# Altium schematic sheet Sheet1.SchDoc
size A3
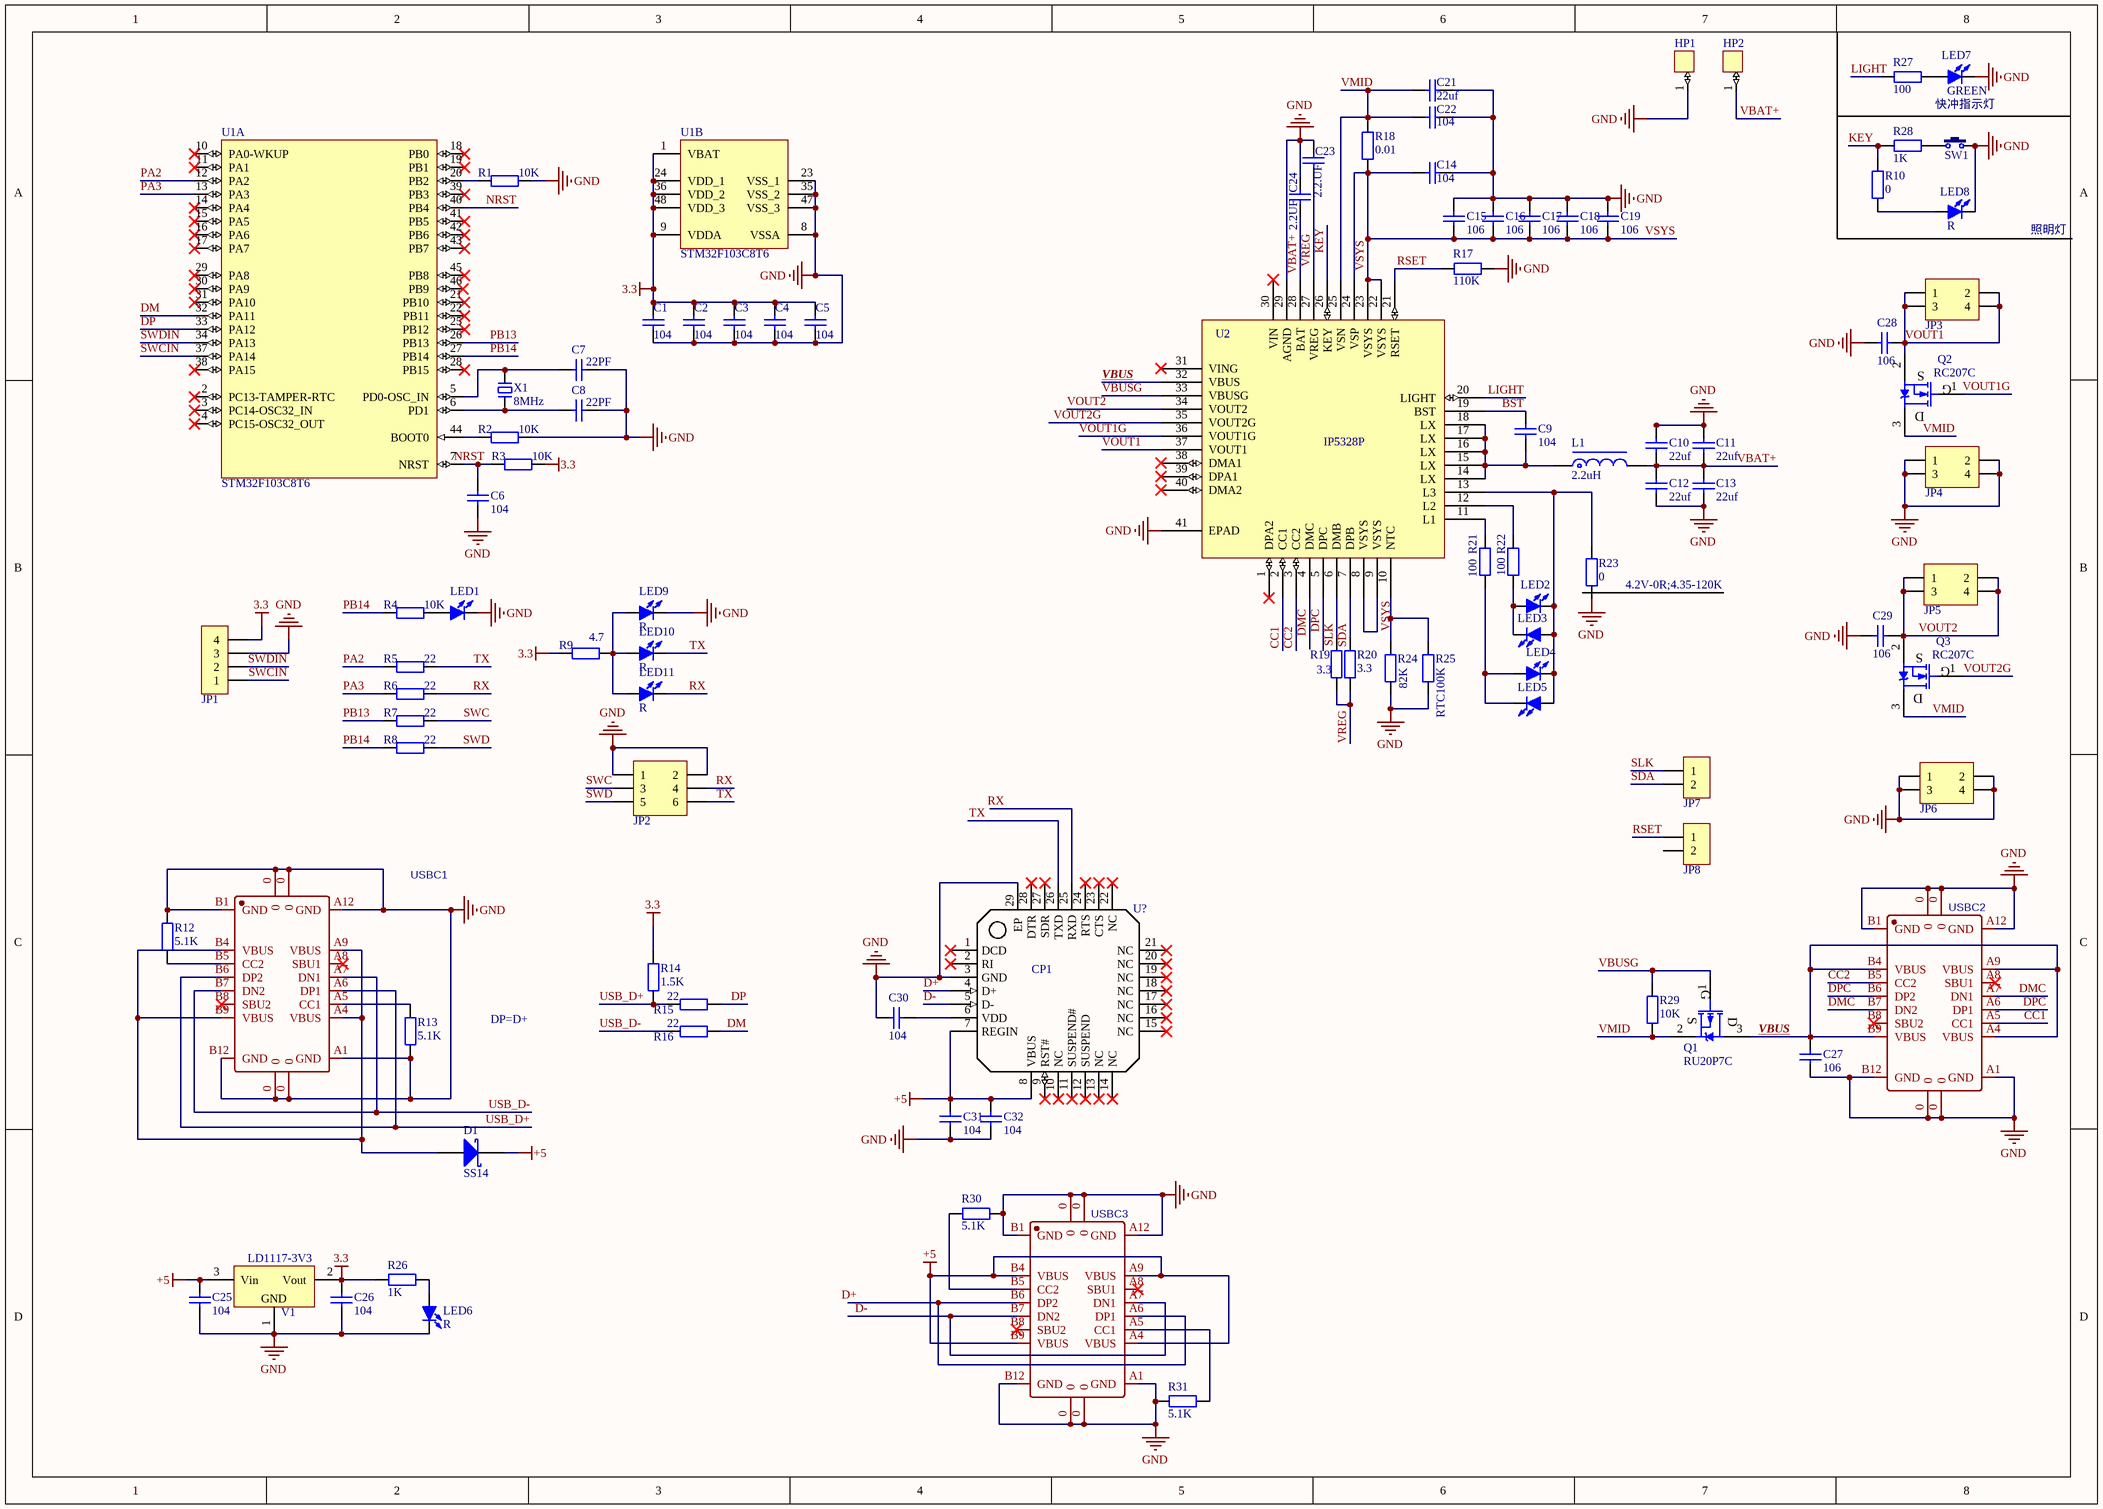
[diagram p0: Sheet1.SchDoc]

## Parts
C1  104  [C 0603_L]
C2  104  [C 0603_L]
C3  104  [C 0603_L]
C4  104  [C 0603_L]
C5  104  [C 0603_L]
C6  104  [C 0603_L]
C7  22PF  [C 0603_L]
C8  22PF  [C 0603_L]
C9  104  [C 0603_L]
C10  22uf  [C 0603_L]
C11  22uf  [C 0603_L]
C12  22uf  [C 0603_L]
C13  22uf  [C 0603_L]
C14  104  [C 0603_L]
C15  106  [C 0603_L]
C16  106  [C 0603_L]
C17  106  [C 0603_L]
C18  106  [C 0603_L]
C19  106  [C 0603_L]
C21  22uf  [C 0603_L]
C22  104  [C 0603_L]
C23  2.2.UF  [C 0603_L]
C24  2.2UF  [C 0603_L]
C25  104  [C 0603_L]
C26  104  [C 0603_L]
C27  106  [C 0603_L]
C28  106  [C 0603_L]
C29  106  [C 0603_L]
C30  104  [C 0603_L]
C31  104  [C 0603_L]
C32  104  [C 0603_L]
CP1  U?  [QFN28 5x5_N]
D1  SS14  [SOD-123]
HP1  (no value)  [焊盘1.5X1.5]
HP2  (no value)  [焊盘1.5X1.5]
JP1  HDR-1X4  [HDR2.54-LI-4P]  (value not drawn)
JP2  Header3X2  [HDR2.54-LI-2x3P]  (value not drawn)
JP3  Header2X2  [HDR2.54-LI-2x2P]  (value not drawn)
JP4  Header2X2  [HDR2.54-LI-2x2P]  (value not drawn)
JP5  Header2X2  [HDR2.54-LI-2x2P]  (value not drawn)
JP6  Header2X2  [HDR2.54-LI-2x2P]  (value not drawn)
JP7  HDR-1X2  [HDR2.54-LI-2P]  (value not drawn)
JP8  HDR-1X2  [HDR2.54-LI-2P]  (value not drawn)
L1  2.2uH  [CDRH73]
LED1  (no value)  [LED 0603R]
LED2  (no value)  [LED 0603R]
LED3  (no value)  [LED 0603R]
LED4  (no value)  [LED 0603R]
LED5  (no value)  [LED 0603R]
LED6  R  [LED 0603R]
LED7  GREEN  [LED 0603R]
LED8  R  [LED 5730-V]
LED9  R  [LED 0603Y]
LED10  R  [LED 0603Y]
LED11  R  [LED 0603Y]
Q1  RU20P7C  [SOT23-3N]
Q2  RC207C  [SOT23-3N]
Q3  RC207C  [SOT23-3N]
R1  10K  [R 0603_L]
R2  10K  [R 0603_L]
R3  10K  [R 0603_L]
R4  10K  [R 0603_L]
R5  22  [R 0603_L]
R6  22  [R 0603_L]
R7  22  [R 0603_L]
R8  22  [R 0603_L]
R9  4.7  [R 0603_L]
R10  0  [R 0603_L]
R12  5.1K  [R 0603_L]
R13  5.1K  [R 0603_L]
R14  1.5K  [R 0603_L]
R15  22  [R 0603_L]
R16  22  [R 0603_L]
R17  110K  [R 0603_L]
R18  0.01  [R 1206_L]
R19  3.3  [R 0603_L]
R20  3.3  [R 0603_L]
R21  100  [R 0603_L]
R22  100  [R 0603_L]
R23  0  [R 0603_L]
R24  82K  [R 0603_L]
R25  RTC100K  [R 0603_L]
R26  1K  [R 0603_L]
R27  100  [R 0603_L]
R28  1K  [R 0603_L]
R29  10K  [R 0603_L]
R30  5.1K  [R 0603_L]
R31  5.1K  [R 0603_L]
SW1  3x6x5  [TSW 3*6*4.3-S-W]  (value not drawn)
U1  STM32F103C8T6  [LQFP48_N]  (parts A,B of 2)
U2  IP5328P  [QFN40 6X6_N]
USBC1  TYPE-C 2.0 -16P  [USB-C-SMD_TYPE-C-USB-5]  (value not drawn)
USBC2  TYPE-C 2.0 -16P  [USB-C-SMD_TYPE-C-USB-5]  (value not drawn)
USBC3  TYPE-C 2.0 -16P  [USB-C-SMD_TYPE-C-USB-5]  (value not drawn)
V1  LD1117-3V3  [SOT89_L]
X1  8MHz  [OSC 5032-2P]

## Nets
3.3: C1.2 C2.2 C3.2 C4.2 C5.2 C26.2 JP1.4 R3.2 R9.1 R14.2 R26.1 U1.1(VBAT) U1.9(VDDA) U1.24(VDD_1) U1.36(VDD_2) U1.48(VDD_3) V1.2(Vout)
+5: C25.2 C31.1 C32.1 CP1.7(REGIN) CP1.8(VBUS) D1.2(K) USBC3.A4(VBUS) USBC3.A9(VBUS) USBC3.B4(VBUS) USBC3.B9(VBUS) V1.3(Vin)
GND: C1.1 C2.1 C3.1 C4.1 C5.1 C6.1 C7.1 C8.1 C10.2 C11.2 C12.1 C13.1 C14.1 C15.2 C16.2 C17.2 C18.2 C19.2 C21.1 C22.1 C23.2 C24.2 C25.1 C26.1 C27.1 C28.2 C29.1 C30.2 C31.2 C32.2 CP1.3(GND) CP1.29(EP) HP1.1 JP1.3 JP2.1 JP2.2 JP4.1 JP4.2 JP4.3 JP4.4 JP6.1 JP6.2 JP6.3 JP6.4 LED1.2(K) LED6.2(K) LED7.2(K) LED8.2(K) LED9.2(K) R1.2 R2.2 R12.2 R13.1 R17.2 R23.1 R24.2 R25.2 R30.2 R31.1 SW1.2 U1.8(VSSA) U1.23(VSS_1) U1.35(VSS_2) U1.47(VSS_3) U2.29(AGND) U2.41(EPAD) USBC1.0 USBC1.A1(GND) USBC1.A12(GND) USBC1.B1(GND) USBC1.B12(GND) USBC2.0 USBC2.A1(GND) USBC2.A12(GND) USBC2.B1(GND) USBC2.B12(GND) USBC3.0 USBC3.A1(GND) USBC3.A12(GND) USBC3.B1(GND) USBC3.B12(GND) V1.1(GND)
BST: C9.2 U2.19(BST)
CC1: U2.2(CC1) USBC2.A5(CC1)
CC2: U2.3(CC2) USBC2.B5(CC2)
D+: CP1.4(D+) USBC3.A6(DP1) USBC3.B6(DP2)
D-: CP1.5(D-) USBC3.A7(DN1) USBC3.B7(DN2)
DM: R16.2 U1.32(PA11)
DMC: U2.4(DMC) USBC2.A7(DN1) USBC2.B7(DN2)
DP: R15.2 U1.33(PA12)
DPC: U2.5(DPC) USBC2.A6(DP1) USBC2.B6(DP2)
KEY: R10.2 R28.1 U2.26(KEY)
LIGHT: R27.1 U2.20(LIGHT)
NRST: C6.2 R3.1 U1.7(NRST) U1.40(PB4)
PA2: R5.1 U1.12(PA2)
PA3: R6.1 U1.13(PA3)
PB13: R7.1 U1.26(PB13)
PB14: R4.1 R8.1 U1.27(PB14)
RSET: JP8.1 R17.1 U2.21(RSET)
RX: CP1.25(RXD) JP2.4 LED11.2(K) R6.2
SDA: JP7.2 R20.2 U2.7(DPB)
SLK: JP7.1 R19.1 U2.6(DMB)
SWC: JP2.3 R7.2
SWCIN: JP1.1 U1.37(PA14)
SWD: JP2.5 R8.2
SWDIN: JP1.2 U1.34(PA13)
TX: CP1.26(TXD) JP2.6 LED10.2(K) R5.2
USB_D+: R14.1 R15.1 USBC1.A6(DP1) USBC1.B6(DP2)
USB_D-: R16.1 USBC1.A7(DN1) USBC1.B7(DN2)
VBAT+: C10.1 C11.1 C12.2 C13.2 C24.1 HP2.1 L1.2 U2.28(BAT)
VBUS: C27.2 Q1.3(D) U2.32(VBUS) USBC2.A4(VBUS) USBC2.A9(VBUS) USBC2.B4(VBUS) USBC2.B9(VBUS)
VBUSG: Q1.1(G) R29.2 U2.33(VBUSG)
VMID: C21.2 C22.2 Q1.2(S) Q2.3(D) Q3.3(D) R18.1 R29.1 U2.25(VSN)
VOUT1: C28.1 JP3.1 JP3.2 JP3.3 JP3.4 Q2.2(S) U2.37(VOUT1)
VOUT1G: Q2.1(G) U2.36(VOUT1G)
VOUT2: C29.2 JP5.1 JP5.2 JP5.3 JP5.4 Q3.2(S) U2.34(VOUT2)
VOUT2G: Q3.1(G) U2.35(VOUT2G)
VREG: C23.1 R19.2 R20.1 U2.27(VREG)
VSYS: C14.2 C15.1 C16.1 C17.1 C18.1 C19.1 R18.2 U2.8(VSYS) U2.9(VSYS) U2.22(VSYS) U2.23(VSYS) U2.24(VSP)
NetC7_2: C7.2 U1.5(PD0-OSC_IN) X1.2
NetC8_2: C8.2 U1.6(PD1) X1.1
NetC9_1: C9.1 L1.1 U2.14(LX) U2.15(LX) U2.16(LX) U2.17(LX) U2.18(LX)
NetC30_1: C30.1 CP1.6(VDD)
NetD1_1: D1.1(A) USBC1.A4(VBUS) USBC1.A9(VBUS) USBC1.B4(VBUS) USBC1.B9(VBUS)
NetLED1_1: LED1.1(A) R4.2
NetLED2_1: LED2.1(A) LED3.2(K) R22.1
NetLED2_2: LED2.2(K) LED3.1(A) LED4.2(K) LED5.1(A) R23.2 U2.13(L3)
NetLED4_1: LED4.1(A) LED5.2(K) R21.1
NetLED6_1: LED6.1(A) R26.2
NetLED7_1: LED7.1(A) R27.2
NetLED8_1: LED8.1(A) R10.1
NetLED9_1: LED9.1(A) LED10.1(A) LED11.1(A) R9.2
NetR1_1: R1.1 U1.20(PB2)
NetR2_1: R2.1 U1.44(BOOT0)
NetR12_1: R12.1 USBC1.B5(CC2)
NetR13_2: R13.2 USBC1.A5(CC1)
NetR21_2: R21.2 U2.11(L1)
NetR22_2: R22.2 U2.12(L2)
NetR24_1: R24.1 R25.1 U2.10(NTC)
NetR28_2: R28.2 SW1.1
NetR30_1: R30.1 USBC3.B5(CC2)
NetR31_2: R31.2 USBC3.A5(CC1)

Not connected (* = marked no-connect by the designer): CP1 1(DCD)* 2(RI)* 9(RST#)* 10(NC)* 11(SUSPEND#)* 12(SUSPEND)* 13(NC)* 14(NC)* 15(NC)* 16(NC)* 17(NC)* 18(NC)* 19(NC)* 20(NC)* 21(NC)* 22(NC)* 23(CTS)* 24(RTS)* 27(SDR)* 28(DTR)*; JP8 2; U1 2(PC13-TAMPER-RTC)* 3(PC14-OSC32_IN)* 4(PC15-OSC32_OUT)* 10(PA0-WKUP)* 11(PA1)* 14(PA4)* 15(PA5)* 16(PA6)* 17(PA7)* 18(PB0)* 19(PB1)* 21(PB10)* 22(PB11)* 25(PB12)* 28(PB15)* 29(PA8)* 30(PA9)* 31(PA10)* 38(PA15)* 39(PB3)* 41(PB5)* 42(PB6)* 43(PB7)* 45(PB8)* 46(PB9); U2 1(DPA2)* 30(VIN)* 31(VING)* 38(DMA1)* 39(DPA1)* 40(DMA2)*; USBC1 A8(SBU1)* B8(SBU2)*; USBC2 A8(SBU1)* B8(SBU2)*; USBC3 A8(SBU1)* B8(SBU2)*

## Notes on the sheet
- 快冲指示灯
- 照明灯
- (near R23) 4.2V-0R;4.35-120K
- DP=D+

## Library data of the parts
C1-C19 C21-C32 = C: 贴片电容; BOM名称: 无极性贴片电容; 联系卖家，免费查找封装: 唯一出售店铺网址https://shop463601444.taobao.com; 封装库来自淘宝卖家ID：黄晶宝石: 其他店铺购入均为盗版假冒封装库
CP1 = CP2102N: USB转TTL
D1 = SS14: 肖特基二极管; 属性: 40V/1A; 联系卖家，免费查找封装: 唯一出售店铺网址https://shop463601444.taobao.com; BOM名称: 肖特基二极管
HP1 HP2 = HP?
JP1 = Header 4: 4P接插件; 封装库来自淘宝卖家 ID：黄晶宝石: 其他店铺购入均为盗版假冒封装库; 联系卖家，免费查找封装: 唯一出售店铺网址https://shop463601444.taobao.com; BOM名称: 4P接插件
JP2 = Header 3X2: 3*2P接插件; 封装库来自淘宝卖家 ID：黄晶宝石: 其他店铺购入均为盗版假冒封装库; 联系卖家，免费查找封装: 唯一出售店铺网址https://shop463601444.taobao.com; BOM名称: 3*2P接插件
JP3-JP6 = Header 2X2: 2*2P接插件; 封装库来自淘宝卖家 ID：黄晶宝石: 其他店铺购入均为盗版假冒封装库; 联系卖家，免费查找封装: 唯一出售店铺网址https://shop463601444.taobao.com; BOM名称: 2*2P接插件
JP7 JP8 = Header 2: 2P接插件; 封装库来自淘宝卖家 ID：黄晶宝石: 其他店铺购入均为盗版假冒封装库; 联系卖家，免费查找封装: 唯一出售店铺网址https://shop463601444.taobao.com; BOM名称: 2P接插件
L1 = L-CDRH: 功率屏蔽电感; 联系卖家，免费查找封装: 唯一出售店铺网址https://shop463601444.taobao.com; 封装库来自淘宝卖家ID：黄晶宝石: 其他店铺购入均为盗版假冒封装库; BOM名称: 功率屏蔽电感
LED1-LED11 = LED-SMD: 贴片LED; 封装库来自淘宝卖家 ID：黄晶宝石: 其他店铺购入均为假冒，请立即申请退款，本店奖励2~5元现金; BOM名称: 贴片LED
Q1 = RU20P7C: PMOS / Rds(on)<20m ohm      I>=4A
Q2 Q3 = RU207C: NMOS / Rds(on)<20m ohm      I>=4A
R1-R10 R12-R31 = R: 贴片电阻; 联系卖家，免费查找封装: 唯一出售店铺网址https://shop463601444.taobao.com; 封装库来自淘宝卖家ID：黄晶宝石: 其他店铺购入均为盗版假冒封装库; BOM名称: 贴片电阻
SW1 = TSW 3x6: 3x6轻触开关; 联系卖家，免费查找封装: 唯一出售店铺网址https://shop463601444.taobao.com; BOM名称: 3x6轻触开关
U1 = STM32F103C8T6: STM32 ARM-based 32-bit MCU Performance Line with 64 kB Flash, 20 kB Internal RAM, -40 to +85癈 Temperature, 48-Pin LQFP, Tray; 联系卖家，免费查找封装: 唯一出售店铺网址https://shop463601444.taobao.com; DatasheetVersion: rev13.0, Apr-2011; PackageVersion: rev13, Apr-2011; PackageReference: LQFP48; PackageDescription: 48-Pin Low-Profile Quad Flat Pack, 7 x 7 mm Body, 0.5 mm Pitch (LQFP48); ComponentLink1Description: Manufacturer URL; ComponentLink1URL: http://www.st.com/; ComponentLink2Description: STM32F103 Datasheet; ComponentLink2URL: http://www.st.com/internet/com/TECHNICAL_RESOURCES/TECHNICAL_LITERATURE/DATASHEET/CD00161566.pdf; ComponentLink3Description: STM32 Family Web Page; ComponentLink3URL: www.st.com/stm32
USBC1-USBC3 = USB2.0 Type-C 16Pin母座: USB2.0 Type-C 母座 16Pin; 联系卖家，免费技术支持: 唯一出售店铺网址https://shop463601444.taobao.com
V1 = LD1117: 三端稳压芯片; BOM名称: 稳压芯片; 封装库来自淘宝卖家 ID：黄晶宝石: 其他店铺购入均为假冒，请立即申请退款，本店奖励2~5元现金
X1 = XTAL-2P: 2脚无源脚晶振; 联系卖家，免费查找封装: 唯一出售店铺网址https://shop463601444.taobao.com; BOM名称: 2脚无源脚晶振